# Altium schematic sheet Load_Cell_Board.SchDoc
size A3; Organization: Altium Limited; Address1: L3, 12a Rodborough Rd; Address2: Frenchs Forest; Address3: NSW; Address4: Australia 2086; SheetNumber: 1; SheetTotal: 1
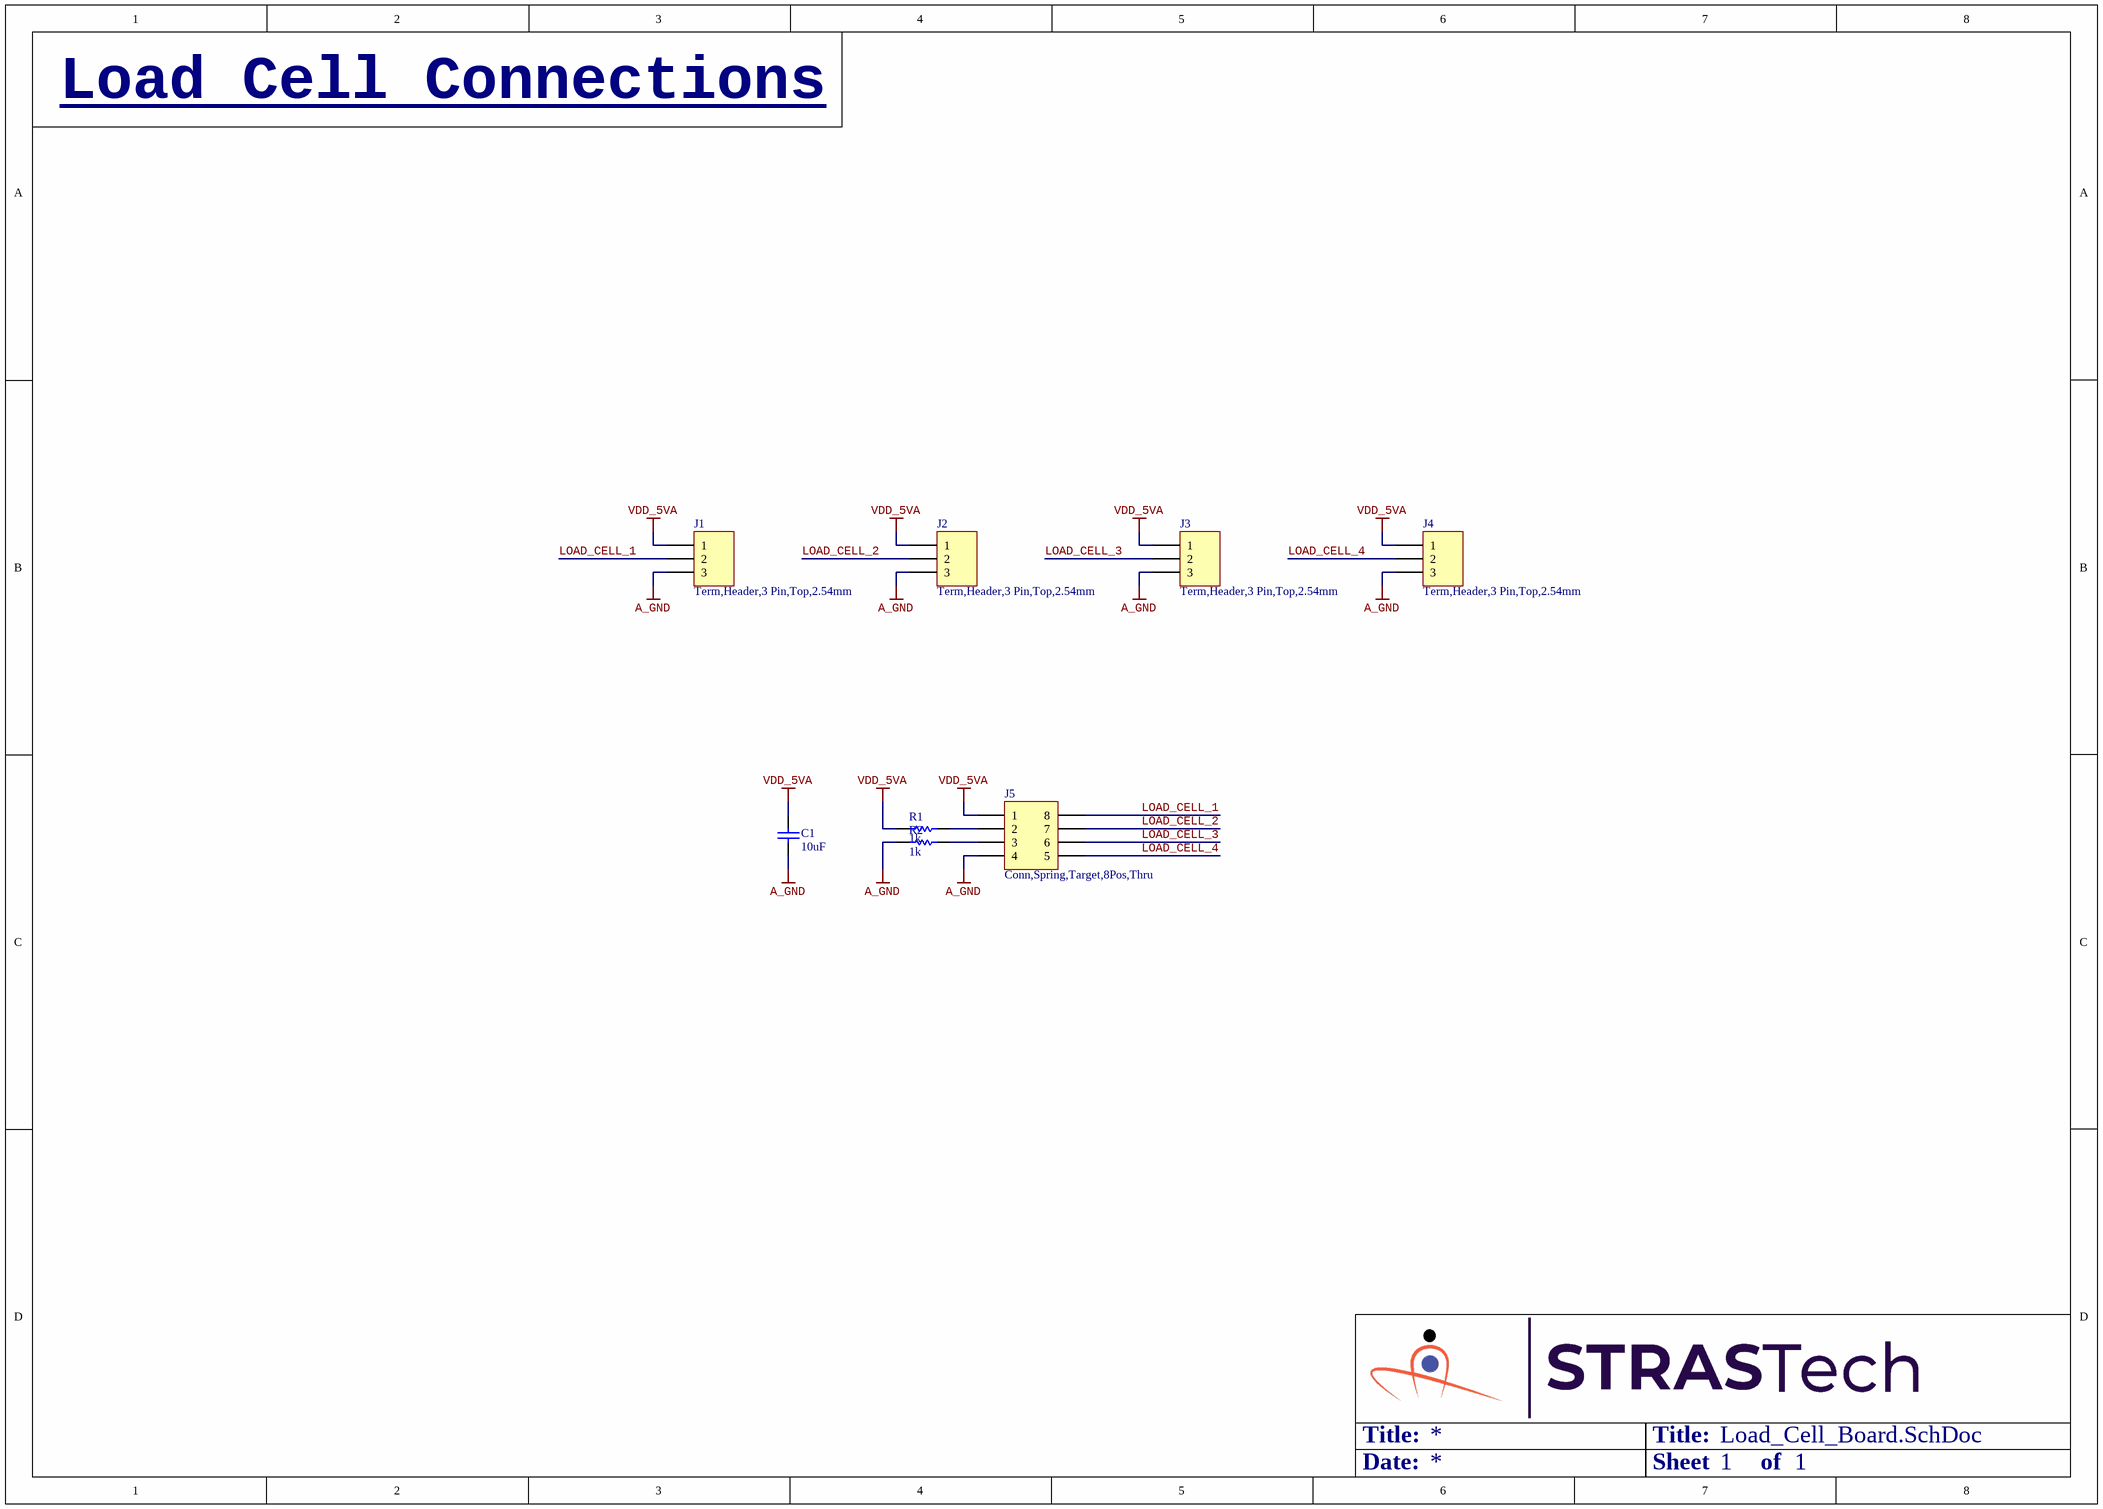
[diagram p0: Load_Cell_Board.SchDoc]

## Parts
C1  10uF  [Cap,SMD,0402]
J1  Term,Header,3 Pin,Top,2.54mm  [Term,Header,3Pin,2.54mm]
J2  Term,Header,3 Pin,Top,2.54mm  [Term,Header,3Pin,2.54mm]
J3  Term,Header,3 Pin,Top,2.54mm  [Term,Header,3Pin,2.54mm]
J4  Term,Header,3 Pin,Top,2.54mm  [Term,Header,3Pin,2.54mm]
J5  Conn,Spring,Target,8Pos,Thru  [Conn,Spring,Target,8Pos,Thru]
R1  1k  [RES,0402]
R2  1k  [RES,0402]

## Nets
A_GND: C1.1 J1.3 J2.3 J3.3 J4.3 J5.4 R2.1
VDD_5VA: C1.2 J1.1 J2.1 J3.1 J4.1 J5.1 R1.1
LOAD_CELL_1: J1.2 J5.8
LOAD_CELL_2: J2.2 J5.7
LOAD_CELL_3: J3.2 J5.6
LOAD_CELL_4: J4.2 J5.5
NetJ5_2: J5.2 R1.2
NetJ5_3: J5.3 R2.2

## Notes on the sheet
- Load Cell Connections
- Title:
- Date:
- Sheet
- of
- Title
- Size:
- A3
- Revision:
- Design By:

## Library data of the parts
C1 = CAP,Cer,10uF,10VDC,X5R,0402: 10 µF ±20% 10V Ceramic Capacitor X5R 0402 (1005 Metric); Vendor Part Number: 1276-1450-1-ND; Manufacturer: Samsung Electro-Mechanics; Manufacturer Part Number: CL05A106MP5NUNC; Vendor: Digikey; HelpURL: https://media.digikey.com/pdf/Data%20Sheets/Samsung%20PDFs/CL05A106MP5NUNC_Spec.pdf; CreatedBy: Judd Foster
J1-J4 = Term,Header,3 Pin,Top,2.54mm: CONN HEADER VERT 3POS 2.54MM; Vendor Part Number: 732-5316-ND; Manufacturer: Würth Elektronik; Manufacturer Part Number: 61300311121; Vendor: Digikey; HelpURL: https://katalog.we-online.de/em/datasheet/6130xx11121.pdf; Created By: Judd Foster
J5 = Conn,Spring,Target,8Pos,Thru: 8 Position Spring Mating Target Connector Through Hole; Manufacturer: Mill-Max Manufacturing Corp.; Manufacturer Part Number: 419-10-208-00-006000; Vendor Part Number: ED1377-ND; Vendor: Digikey; CreatedBy: Judd Foster; HelpURL: https://www.mill-max.com/catalog/download/2017-11%3A021.pdf
R1 R2 = RES,1k,5%,0.063W,0402: 1 kOhms ±5% 0.063W, 1/16W Chip Resistor 0402 (1005 Metric) Automotive AEC-Q200 Thick Film; Vendor Part Number: RMCF0402JT1K00CT-ND; Manufacturer: Stackpole Electronics Inc; Manufacturer Part Number: RMCF0402JT1K00; Vendor: DIgikey; HelpURL: https://www.seielect.com/catalog/sei-rmcf_rmcp.pdf; CreatedBy: Judd Foster